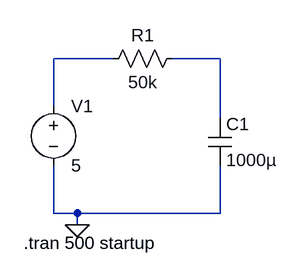
[diagram p0: schematic Draft4.asc]
Draft4.asc, the LTspice schematic file:
Version 4
SHEET 1 880 680
WIRE 192 48 112 48
WIRE 336 48 272 48
WIRE 112 112 112 48
WIRE 336 128 336 48
WIRE 112 256 112 192
WIRE 144 256 112 256
WIRE 336 256 336 192
WIRE 336 256 144 256
WIRE 144 272 144 256
FLAG 144 272 0
SYMBOL voltage 112 96 R0
WINDOW 123 0 0 Left 0
WINDOW 39 0 0 Left 0
SYMATTR InstName V1
SYMATTR Value 5
SYMBOL res 288 32 R90
WINDOW 0 0 56 VBottom 2
WINDOW 3 32 56 VTop 2
SYMATTR InstName R1
SYMATTR Value 50k
SYMBOL cap 320 128 R0
SYMATTR InstName C1
SYMATTR Value 1000µ
TEXT 72 296 Left 2 !.tran 500 startup

The netlist it stands for:
* Draft4.asc
V1 N001 0 5
R1 N002 N001 50k
C1 N002 0 1000µ
.tran 500 startup
.backanno
.end